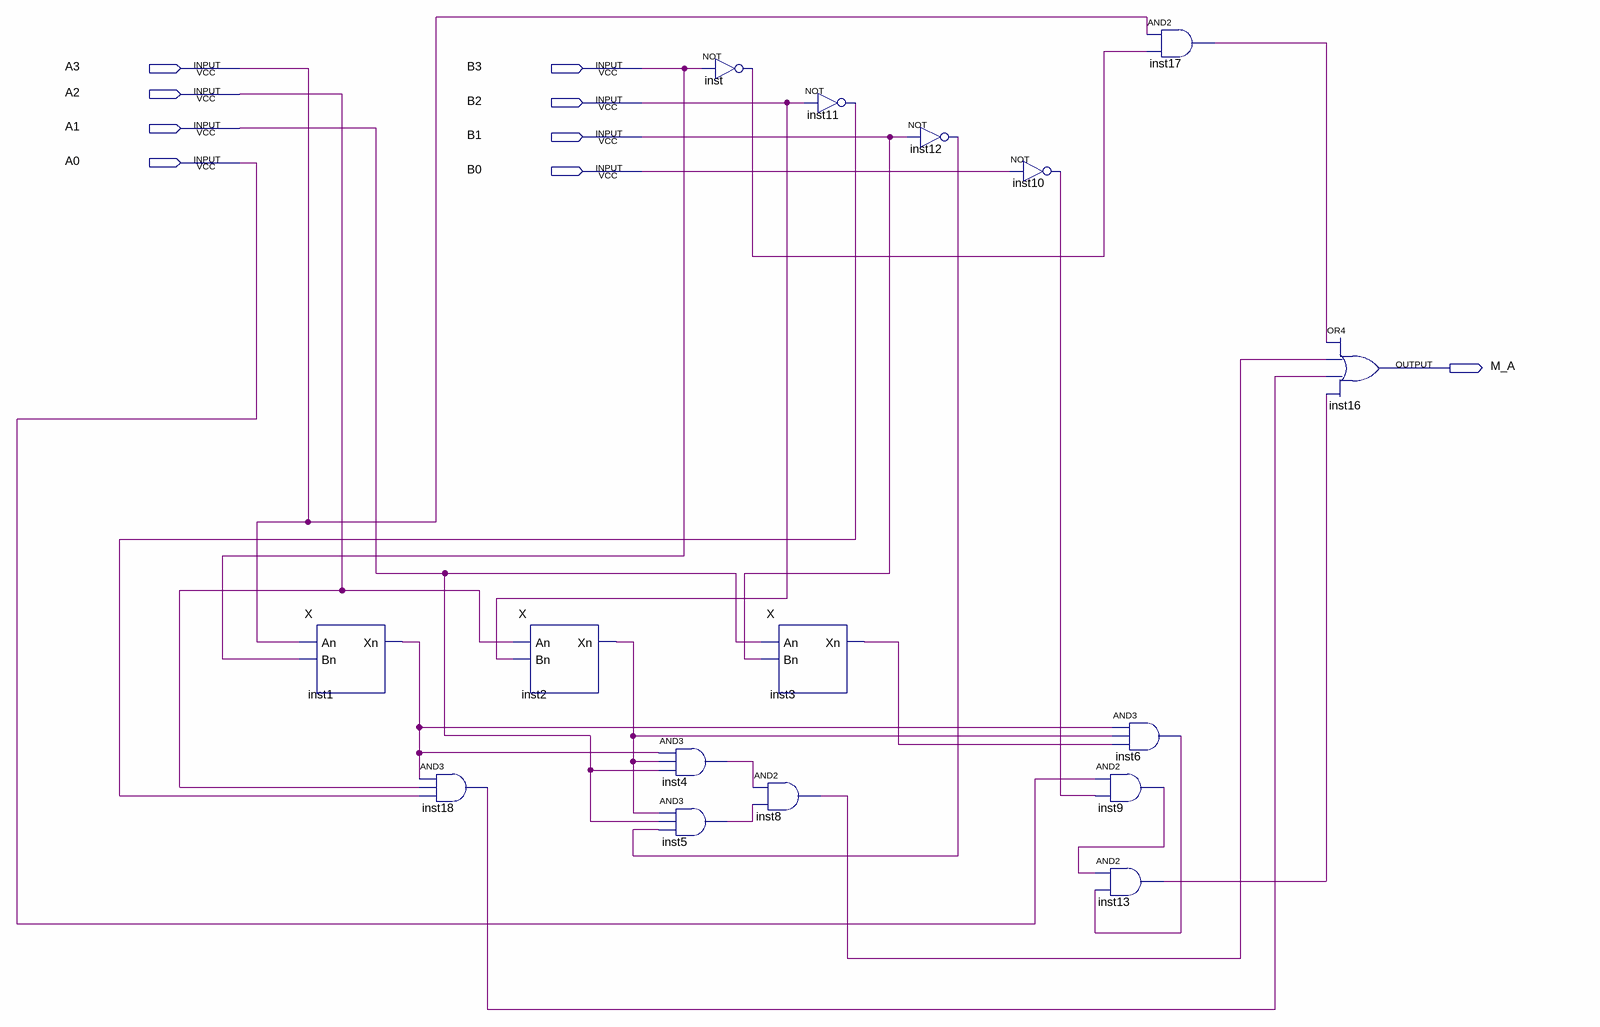
[diagram p0: schematic sheet]
// Quartus schematic CompMagnitude_M_A.bdf as structural Verilog: 16 symbols, 9 pins
module CompMagnitude_M_A (
  input  A3,
  input  B3,
  input  A2,
  input  B2,
  input  A1,
  input  B1,
  input  A0,
  input  B0,
  output M_A
);

  wire inst1_xn, inst2_xn, inst3_xn, inst4_out, inst5_out, inst6_out, inst8_out, inst9_out, inst10_out,
       inst11_out, inst12_out, inst13_out, inst17_out, inst18_out, inst_out;

  X inst1 (.An(A3), .Bn(B3), .Xn(inst1_xn));
  and inst18 (inst18_out, inst1_xn, A2, inst11_out);
  X inst2 (.An(A2), .Bn(B2), .Xn(inst2_xn));
  not inst (inst_out, B3);
  and inst4 (inst4_out, inst1_xn, inst2_xn, A1);
  and inst5 (inst5_out, inst2_xn, A1, inst12_out);
  X inst3 (.An(A1), .Bn(B1), .Xn(inst3_xn));
  and inst8 (inst8_out, inst4_out, inst5_out);
  not inst11 (inst11_out, B2);
  not inst12 (inst12_out, B1);
  not inst10 (inst10_out, B0);
  and inst6 (inst6_out, inst1_xn, inst2_xn, inst3_xn);
  and inst9 (inst9_out, A0, inst10_out);
  and inst13 (inst13_out, inst9_out, inst6_out);
  and inst17 (inst17_out, A3, inst_out);
  or inst16 (M_A, inst17_out, inst8_out, inst18_out, inst13_out);
endmodule
